# Altium schematic sheet 05_Wifi_Interface.SchDoc: Mainboard Wifi
size A3; SheetNumber: 9; SheetTotal: 13
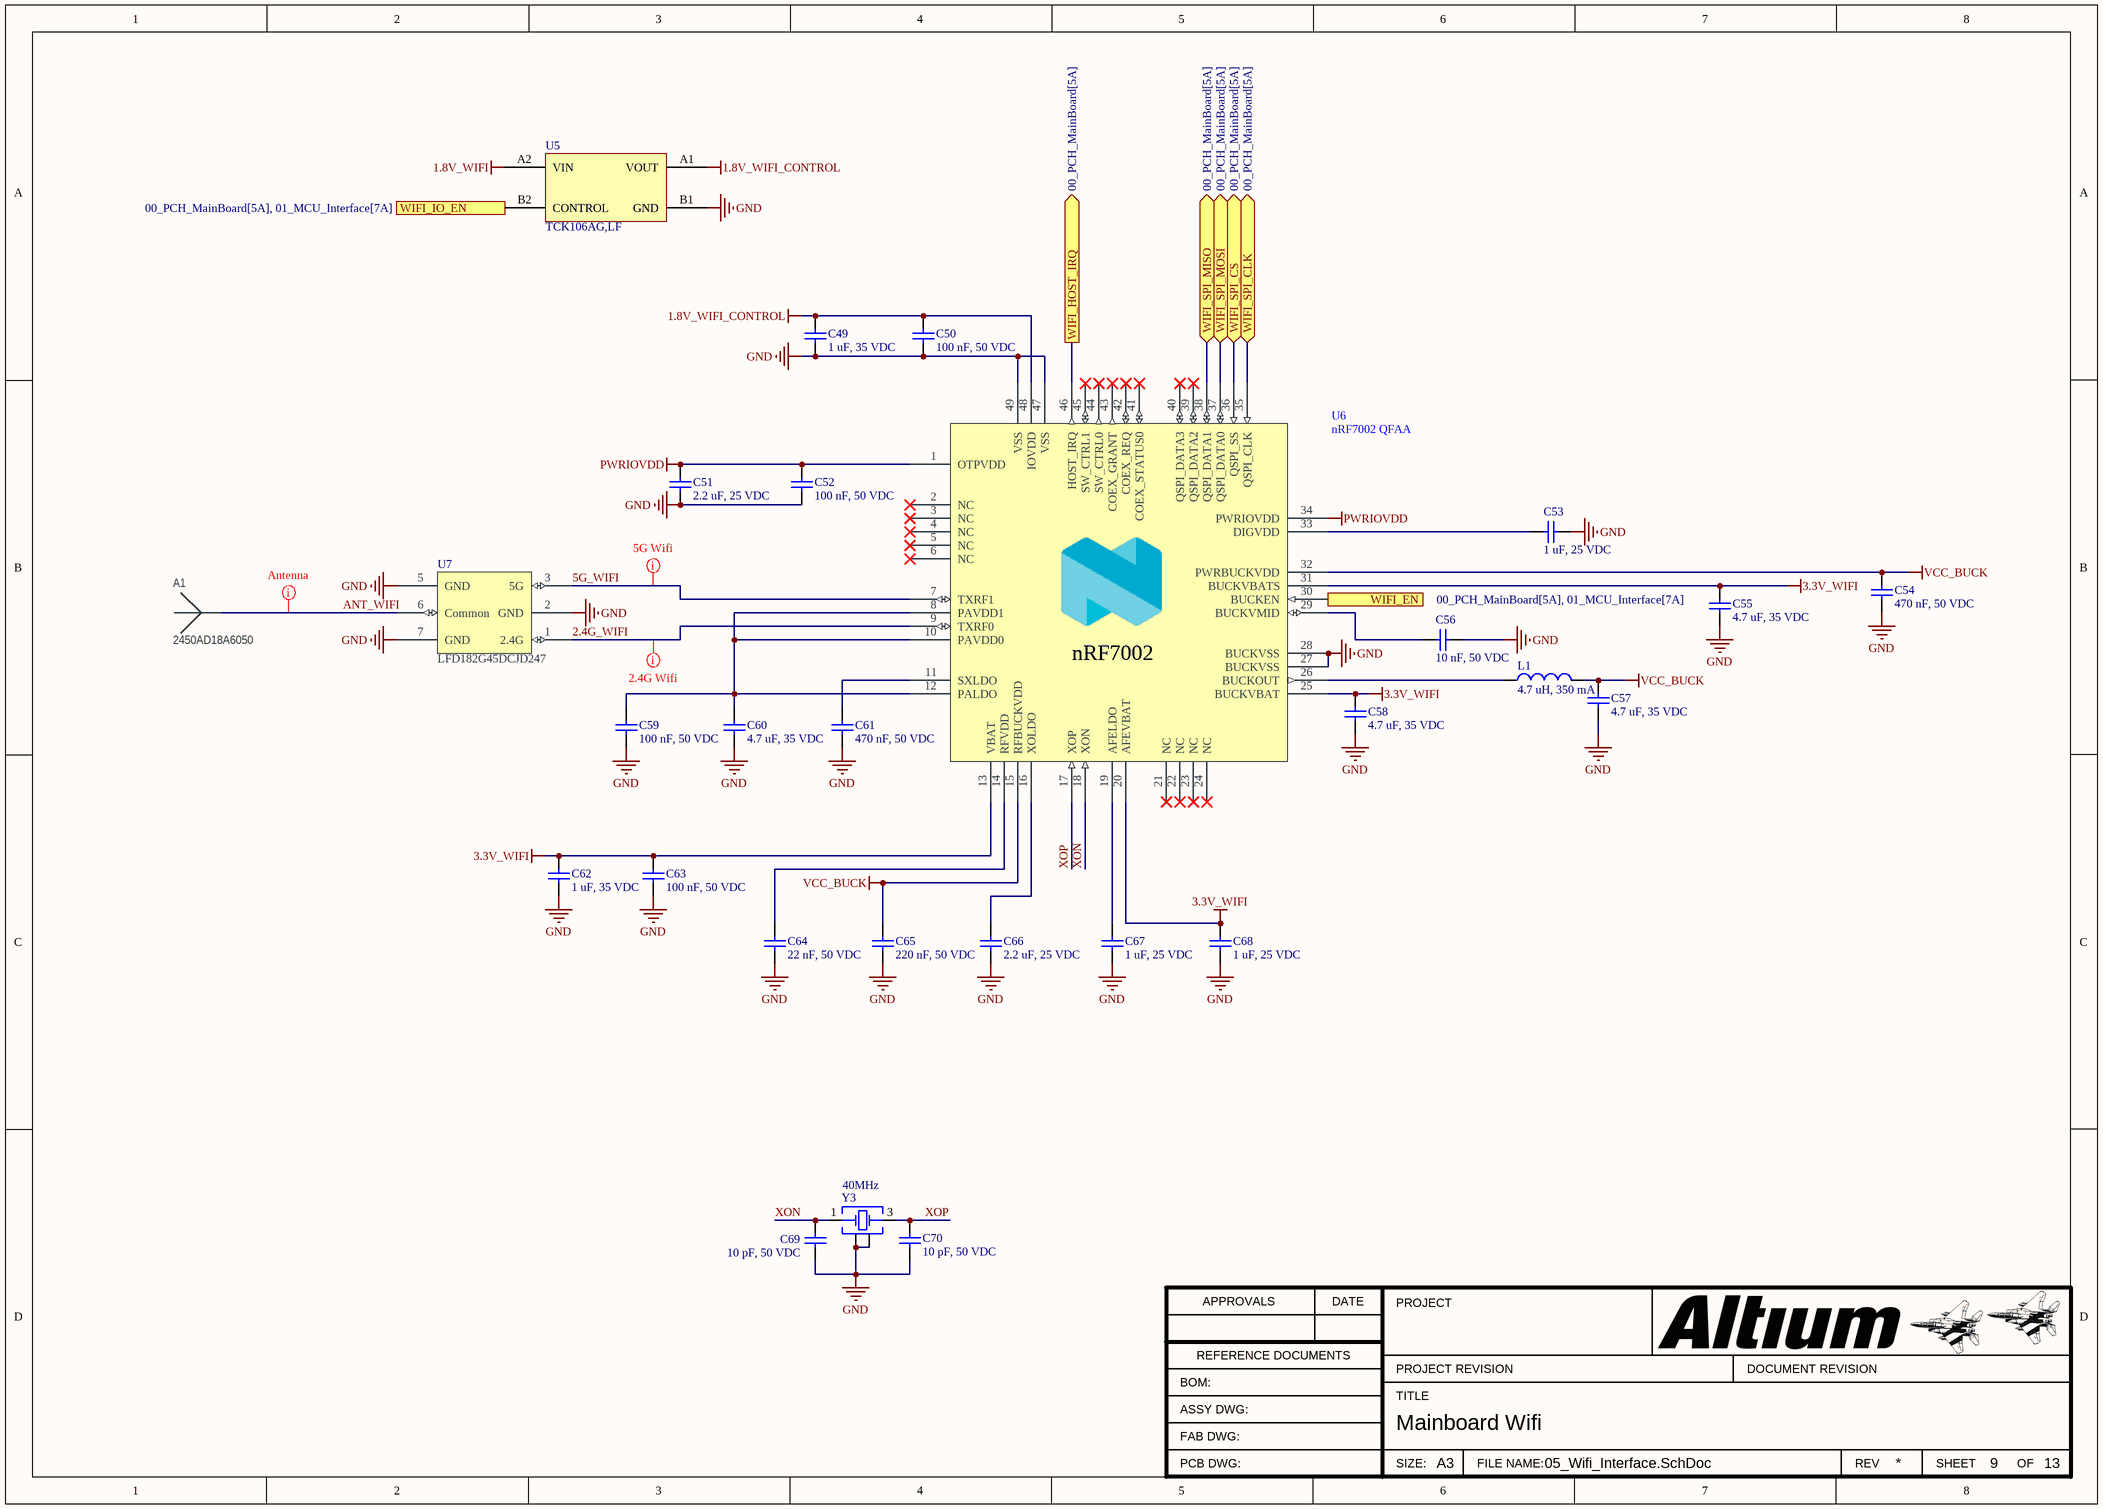
[diagram p0: 05_Wifi_Interface.SchDoc]

## Parts
A1  2450AD18A6050  [2450AD18A6050]
C49  1 uF, 35 VDC  [CAP_0603]
C50  100 nF, 50 VDC  [CAP_0603]
C51  2.2 uF, 25 VDC  [CAP_0603]
C52  100 nF, 50 VDC  [CAP_0603]
C53  1 uF, 25 VDC  [CAP_0603]
C54  470 nF, 50 VDC  [CAP_0603]
C55  4.7 uF, 35 VDC  [CAP_0603]
C56  10 nF, 50 VDC  [CAP_0603]
C57  4.7 uF, 35 VDC  [CAP_0603]
C58  4.7 uF, 35 VDC  [CAP_0603]
C59  100 nF, 50 VDC  [CAP_0603]
C60  4.7 uF, 35 VDC  [CAP_0603]
C61  470 nF, 50 VDC  [CAP_0603]
C62  1 uF, 35 VDC  [CAP_0603]
C63  100 nF, 50 VDC  [CAP_0603]
C64  22 nF, 50 VDC  [CAP_0603]
C65  220 nF, 50 VDC  [CAP_0603]
C66  2.2 uF, 25 VDC  [CAP_0603]
C67  1 uF, 25 VDC  [CAP_0603]
C68  1 uF, 25 VDC  [CAP_0603]
C69  10 pF, 50 VDC  [CAP_0603]
C70  10 pF, 50 VDC  [CAP_0603]
L1  4.7 uH, 350 mA  [0603]
U5  TCK106AG,LF  [TCK106AG,LF]
U6  nRF7002 QFAA  [nRF7002]
U7  value LFD182G45DCJD247  [CAF-50P160X80-6N]  (hidden comment: LFD_Diplexer)
Y3  40MHz  [WE-XTAL_CFPX-180]

## Ports
WIFI_EN (in, see 00_PCH_MainBoard[5A], 01_MCU_Interface[7A]), WIFI_HOST_IRQ (out, see 00_PCH_MainBoard[5A]), WIFI_IO_EN (in, see 00_PCH_MainBoard[5A], 01_MCU_Interface[7A]), WIFI_SPI_CLK (bidir, see 00_PCH_MainBoard[5A]), WIFI_SPI_CS (bidir, see 00_PCH_MainBoard[5A]), WIFI_SPI_MISO (bidir, see 00_PCH_MainBoard[5A]), WIFI_SPI_MOSI (bidir, see 00_PCH_MainBoard[5A])

## Nets
1.8V_WIFI: U5.A2(VIN)
1.8V_WIFI_CONTROL: C49.2 C50.2 U5.A1(VOUT) U6.48(IOVDD)
3.3V_WIFI: C55.2 C58.2 C62.2 C63.2 C68.2 U6.13(VBAT) U6.20(AFEVBAT) U6.25(BUCKVBAT) U6.31(BUCKVBATS)
GND: C49.1 C50.1 C51.1 C52.1 C53.2 C54.1 C55.1 C56.2 C57.1 C58.1 C59.1 C60.1 C61.1 C62.1 C63.1 C64.1 C65.1 C66.1 C67.1 C68.1 C69.1 C70.1 U5.B1(GND) U6.27(BUCKVSS) U6.28(BUCKVSS) U6.47(VSS) U6.49(VSS) U7.2(GND) U7.5(GND) U7.7(GND) Y3.2(GND) Y3.4(GND)
PWRIOVDD: C51.2 C52.2 U6.1(OTPVDD) U6.34(PWRIOVDD)
VCC_BUCK: C54.2 C57.2 C65.2 L1.2 U6.15(RFBUCKVDD) U6.32(PWRBUCKVDD)
2.4G_WIFI: U6.9(TXRF0) U7.1(2.4G)
5G_WIFI: U6.7(TXRF1) U7.3(5G)
ANT_WIFI: A1.1 U7.6(Common)
WIFI_EN: U6.30(BUCKEN) ; port WIFI_EN
WIFI_HOST_IRQ: U6.46(HOST_IRQ) ; port WIFI_HOST_IRQ
WIFI_IO_EN: U5.B2(CONTROL) ; port WIFI_IO_EN
WIFI_SPI_CLK: U6.35(QSPI_CLK) ; port WIFI_SPI_CLK
WIFI_SPI_CS: U6.36(QSPI_SS) ; port WIFI_SPI_CS
WIFI_SPI_MISO: U6.38(QSPI_DATA1) ; port WIFI_SPI_MISO
WIFI_SPI_MOSI: U6.37(QSPI_DATA0) ; port WIFI_SPI_MOSI
XON: C69.2 U6.18(XON) Y3.1(Crystal)
XOP: C70.2 U6.17(XOP) Y3.3(Crystal)
NetC53_1: C53.1 U6.33(DIGVDD)
NetC56_1: C56.1 U6.29(BUCKVMID)
NetC59_2: C59.2 C60.2 U6.8(PAVDD1) U6.10(PAVDD0) U6.12(PALDO)
NetC61_2: C61.2 U6.11(SXLDO)
NetC64_2: C64.2 U6.14(RFVDD)
NetC66_2: C66.2 U6.16(XOLDO)
NetC67_2: C67.2 U6.19(AFELDO)
NetL1_1: L1.1 U6.26(BUCKOUT)

Not connected (* = marked no-connect by the designer): U6 2(NC)* 3(NC)* 4(NC)* 5(NC)* 6(NC)* 21(NC)* 22(NC)* 23(NC)* 24(NC)* 39(QSPI_DATA2)* 40(QSPI_DATA3)* 41(COEX_STATUS0)* 42(COEX_REQ)* 43(COEX_GRANT)* 44(SW_CTRL0)* 45(SW_CTRL1)*

## Layout directives
rule Signal Stimulus [Kind - Periodic Pulse    Level - Low    Start Time = 0.000    Stop Time = 0.000    Period Time = 200.0p]; net class WIFI: 5G_WIFI
rule Signal Stimulus [Kind - Periodic Pulse    Level - Low    Start Time = 0.000    Stop Time = 0.000    Period Time = 416.7p]; net class WIFI: 2.4G_WIFI
rule Signal Stimulus [Kind - Single Pulse    Level - Low    Start Time = 0.000    Stop Time = 0.000    Period Time = 200.0p]; net class WIFI: ANT_WIFI

## Notes on the sheet
- APPROVALS
- DATE
- PROJECT
- BOM:
- REFERENCE DOCUMENTS
- TITLE
- PROJECT REVISION
- DOCUMENT REVISION
- ASSY DWG:
- FAB DWG:
- PCB DWG:
- SIZE:
- A3
- FILE NAME:
- REV
- SHEET
- OF

## Library data of the parts
A1 = 2450AD18A6050: 2.4, 5, and 6GHz BT/WiFi6E Mini Antenna, Single-feed, Tri-band, Corner Mount; Manufacturer: Johanson Technology; Part number NEMS: 100700074; Pad Count: 2; Note: N.A.; Component Status: Active; Part Number: 2450AD18A6050; PartId: 100700074; Component Class: Antennas; Author: hany; Manufacturer Part Number: 2450AD18A6050; ComponentLink1URL: https://www.johansontechnology.com/datasheets/2450AD18A6050/2450AD18A6050.pdf; ComponentLink1Description: Datasheet; ComponentLink2URL: N.A.; ComponentLink2Description: Supplier link; HelpURL: N.A.; Footprint Doc: 2450AD18A6050; LatestRevisionDate: 2022-01-21; Published: 2022-01-21; Value: 2450AD18A6050; Supplier 1: Digi-Key; Supplier Part Number 1: 712-2450AD18A6050ETR-ND; Supplier 2: Mouser; Supplier Part Number 2: 609-2450AD18A6050; Artikkelnr Noca: N.A.; Part number IPS: N.A.; Part number Norautron: N.A.; Supplier 1 URL: https://www.mouser.vn/ProductDetail/Johanson-Technology/2450AD18A6050?qs=XAiT9M5g4x9yG1njx84DMw%3D%3D; Supplier 2 URL: N.A
C49 C62 = 0106031051035: CAP, size 0603, 1 uF, 35 VDC; Manufacture Name: Samsung Electro-Mechanics; Manufacture SN: CL10B105KL9VPJC; Capacitance: 1 uF; Tolerance: +/-10%; Voltage Rating DC: 35 VDC; ComponentLink2Description: Datasheet; ComponentLink2URL: https://www.mouser.vn/datasheet/2/585/Samsung_3_7_2023_CL21Y106KABVPN_Specsheet-3106720.pdf; Operating Temperature: -55 to +125degC; Packaging: Tape and Reel; Mounting Technology: SMT; Size: 0603; Supplier 1 Name: Mouser; Supplier 1 SN: 187-CL10B105KL9VPJC; Supplier 1 URL: https://www.mouser.vn/ProductDetail/Samsung-Electro-Mechanics/CL10B105KL9VPJC?qs=Jm2GQyTW%2Fbg7HPXOYntRzg%3D%3D&utm_source=mouser-refine-download&utm_medium=file&utm_campaign=CL10B105KL9VPJC&utm_content=Samsung-Electro-Mechanics; Supplier 2 Name: Digi-Key; Supplier 2 SN: N/A; Supplier 2 URL: N/A; Supplier 3 Name: thegioiic; Supplier 3 SN: N/A; Supplier 3 URL: N/A; Value: 1 uF, 35 VDC
C50 C52 C59 C63 = 0106031041050: CAP, size 0603, 100 nF, 50 VDC; Manufacture Name: TDK; Manufacture SN: CGA3E3X8R1H104K080AE; Capacitance: 100 nF; Tolerance: +/-10%; Voltage Rating DC: 50 VDC; ComponentLink2Description: Datasheet; ComponentLink2URL: https://product.tdk.com/system/files/dam/doc/product/capacitor/ceramic/mlcc/catalog/mlcc_automotive_soft_en.pdf?ref_disty=mouser; Operating Temperature: -55 to +125degC; Packaging: Tape and Reel; Mounting Technology: SMT; Size: 0603; Supplier 1 Name: Mouser; Supplier 1 SN: 810-CGA3E3X8R1H104KA; Supplier 1 URL: https://www.mouser.com/ProductDetail/TDK/CGA3E3X8R1H104K080AE?qs=nQSIdc08i%252Bd8g3IRRgU2bw%3D%3D&utm_source=mouser-refine-download&utm_medium=file&utm_campaign=CGA3E3X8R1H104K080AE&utm_content=TDK; Supplier 2 Name: Digi-Key; Supplier 2 SN: 445-173697-2-ND; Supplier 2 URL: https://www.digikey.com/en/products/detail/tdk-corporation/cga3e3x8r1h104k080ae/5809262; Supplier 3 Name: thegioiic; Supplier 3 SN: N/A; Supplier 3 URL: N/A; Value: 100 nF, 50 VDC
C51 C66 = 0106032251025: CAP, size 0603, 2.2 uF, 25 VDC; Manufacture Name: Samsung Electro-Mechanics; Manufacture SN: CL10A225KA5LNNC; Capacitance: 2.2 uF; Tolerance: +/-10%; Voltage Rating DC: 25 VDC; ComponentLink2Description: Datasheet; ComponentLink2URL: https://www.mouser.vn/datasheet/2/585/MLCC-1837944.pdf; Operating Temperature: -55 to +125degC; Packaging: Tape and Reel; Mounting Technology: SMT; Size: 0603; Supplier 1 Name: Mouser; Supplier 1 SN: 187-CL10A225KA5LNNC; Supplier 1 URL: https://www.mouser.vn/ProductDetail/Samsung-Electro-Mechanics/CL10A225KA5LNNC?qs=xo2MLhA0R3XJQvhdoYgMfw%3D%3D&utm_source=mouser-refine-download&utm_medium=file&utm_campaign=CL10A225KA5LNNC&utm_content=Samsung-Electro-Mechanics; Supplier 2 Name: Digi-Key; Supplier 2 SN: 1276-1878-2-ND; Supplier 2 URL: https://www.digikey.com/en/products/detail/samsung-electro-mechanics/cl10a225ka5lnnc/3887536; Supplier 3 Name: thegioiic; Supplier 3 SN: N/A; Supplier 3 URL: N/A; Value: 2.2 uF, 25 VDC
C53 C67 C68 = 0106031051025: CAP, size 0603, 1 uF, 25 VDC; Manufacture Name: Samsung Electro-Mechanics; Manufacture SN: CL10A105KA8NNNC; Capacitance: 1 uF; Tolerance: +/-10%; Voltage Rating DC: 25 VDC; ComponentLink2Description: Datasheet; ComponentLink2URL: https://www.mouser.vn/datasheet/2/585/MLCC-1837944.pdf; Operating Temperature: -55 to +125degC; Packaging: Tape and Reel; Mounting Technology: SMT; Size: 0603; Supplier 1 Name: Mouser; Supplier 1 SN: 187-CL10A105KA8NNNC; Supplier 1 URL: https://www.mouser.vn/ProductDetail/Samsung-Electro-Mechanics/CL10A105KA8NNNC?qs=hqM3L16%252BxldY%252BnK4KzDJVg%3D%3D&utm_source=mouser-refine-download&utm_medium=file&utm_campaign=CL10A105KA8NNNC&utm_content=Samsung-Electro-Mechanics; Supplier 2 Name: Digi-Key; Supplier 2 SN: 1276-1102-2-ND; Supplier 2 URL: https://www.digikey.com/en/products/detail/samsung-electro-mechanics/cl10a105ka8nnnc/3886760; Supplier 3 Name: thegioiic; Supplier 3 SN: N/A; Supplier 3 URL: N/A; Value: 1 uF, 25 VDC
C54 C61 = 0106034741050: CAP, size 0603, 470 nF, 50 VDC; Manufacture Name: TDK; Manufacture SN: CGA3E3X7R1H474K080AB; Capacitance: 470 nF; Tolerance: +/-10%; Voltage Rating DC: 50 VDC; ComponentLink2Description: Datasheet; ComponentLink2URL: https://product.tdk.com/system/files/dam/doc/product/capacitor/ceramic/mlcc/catalog/mlcc_automotive_general_en.pdf?ref_disty=mouser; Operating Temperature: -55 to +125degC; Packaging: Tape and Reel; Mounting Technology: SMT; Size: 0603; Supplier 1 Name: Mouser; Supplier 1 SN: 810-CGA3E3X7R1H474KB; Supplier 1 URL: https://www.mouser.com/ProductDetail/TDK/CGA3E3X7R1H474K080AB?qs=xLDY6iXSiQYK0oGm7fVVjw%3D%3D&utm_source=mouser-refine-download&utm_medium=file&utm_campaign=CGA3E3X7R1H474K080AB&utm_content=TDK; Supplier 2 Name: Digi-Key; Supplier 2 SN: 445-175200-2-ND; Supplier 2 URL: https://www.digikey.com/en/products/detail/tdk-corporation/cga3e3x7r1h474k080ab/4931467; Supplier 3 Name: thegioiic; Supplier 3 SN: N/A; Supplier 3 URL: N/A; Value: 470 nF, 50 VDC
C55 C57 C58 C60 = 0106034751035: CAP, size 0603, 4.7 uF, 35 VDC; Manufacture Name: Samsung Electro-Mechanics; Manufacture SN: CL10A475KL8NRNC; Capacitance: 4.7 uF; Tolerance: +/-10%; Voltage Rating DC: 35 VDC; ComponentLink2Description: Datasheet; ComponentLink2URL: https://www.mouser.vn/datasheet/2/585/MLCC-1837944.pdf; Operating Temperature: -55 to +125degC; Packaging: Tape and Reel; Mounting Technology: SMT; Size: 0603; Supplier 1 Name: Mouser; Supplier 1 SN: 187-CL10A475KL8NRNC; Supplier 1 URL: https://www.mouser.vn/ProductDetail/Samsung-Electro-Mechanics/CL10A475KL8NRNC?qs=xZ%2FP%252Ba9zWqa0jfvJtp%252BUEg%3D%3D&utm_source=mouser-refine-download&utm_medium=file&utm_campaign=CL10A475KL8NRNC&utm_content=Samsung-Electro-Mechanics; Supplier 2 Name: Digi-Key; Supplier 2 SN: 1276-6794-2-ND; Supplier 2 URL: https://www.digikey.com/en/products/detail/samsung-electro-mechanics/cl10a475kl8nrnc/5961278; Supplier 3 Name: thegioiic; Supplier 3 SN: N/A; Supplier 3 URL: N/A; Value: 4.7 uF, 35 VDC
C56 = 0106031030550: CAP, size 0603, 10 nF, 50 VDC; Manufacture Name: TDK; Manufacture SN: CGA3E2C0G1H103J080AE; Capacitance: 10 nF; Tolerance: +/-5%; Voltage Rating DC: 50 VDC; ComponentLink2Description: Datasheet; ComponentLink2URL: https://product.tdk.com/system/files/dam/doc/product/capacitor/ceramic/mlcc/catalog/mlcc_automotive_soft_en.pdf?ref_disty=mouser; Operating Temperature: -55 to +125degC; Packaging: Tape and Reel; Mounting Technology: SMT; Size: 0603; Supplier 1 Name: Mouser; Supplier 1 SN: 810-CGA3E2C0G1H103J8; Supplier 1 URL: https://www.mouser.com/ProductDetail/TDK/CGA3E2C0G1H103J080AE?qs=P1JMDcb91o6ZkMITrWTUZQ%3D%3D&utm_source=mouser-refine-download&utm_medium=file&utm_campaign=CGA3E2C0G1H103J080AE&utm_content=TDK; Supplier 2 Name: Digi-Key; Supplier 2 SN: 445-CGA3E2C0G1H103J080AETR-ND; Supplier 2 URL: https://www.digikey.com/en/products/detail/tdk-corporation/cga3e2c0g1h103j080ae/11697946; Supplier 3 Name: thegioiic; Supplier 3 SN: N/A; Supplier 3 URL: N/A; Value: 10 nF, 50 VDC
C64 = 0106032231050: CAP, size 0603, 22 nF, 50 VDC; Manufacture Name: TDK; Manufacture SN: CGA3E2X7R1H223K080AE; Capacitance: 22 nF; Tolerance: +/-10%; Voltage Rating DC: 50 VDC; ComponentLink2Description: Datasheet; ComponentLink2URL: https://product.tdk.com/system/files/dam/doc/product/capacitor/ceramic/mlcc/catalog/mlcc_automotive_soft_en.pdf?ref_disty=mouser; Operating Temperature: -55 to +125degC; Packaging: Tape and Reel; Mounting Technology: SMT; Size: 0603; Supplier 1 Name: Mouser; Supplier 1 SN: 810-CGA3E2X7R1H223KA; Supplier 1 URL: https://www.mouser.com/ProductDetail/TDK/CGA3E2X7R1H223K080AE?qs=nQSIdc08i%252Bf9AsEN7N%2FMeQ%3D%3D&utm_source=mouser-refine-download&utm_medium=file&utm_campaign=CGA3E2X7R1H223K080AE&utm_content=TDK; Supplier 2 Name: Digi-Key; Supplier 2 SN: 445-173696-2-ND; Supplier 2 URL: https://www.digikey.com/en/products/detail/tdk-corporation/cga3e2x7r1h223k080ae/5809261; Supplier 3 Name: thegioiic; Supplier 3 SN: N/A; Supplier 3 URL: N/A; Value: 22 nF, 50 VDC
C65 = 0106032241050: CAP, size 0603, 220 nF, 50 VDC; Manufacture Name: TDK; Manufacture SN: CGA3E3X7R1H224K080AE; Capacitance: 220 nF; Tolerance: +/-10%; Voltage Rating DC: 50 VDC; ComponentLink2Description: Datasheet; ComponentLink2URL: https://product.tdk.com/system/files/dam/doc/product/capacitor/ceramic/mlcc/catalog/mlcc_automotive_soft_en.pdf?ref_disty=mouser; Operating Temperature: -55 to +125degC; Packaging: Tape and Reel; Mounting Technology: SMT; Size: 0603; Supplier 1 Name: Mouser; Supplier 1 SN: 810-CGA3E3X7R1H224KA; Supplier 1 URL: https://www.mouser.com/ProductDetail/TDK/CGA3E3X7R1H224K080AE?qs=nQSIdc08i%252Bd73MzLq310Yg%3D%3D&utm_source=mouser-refine-download&utm_medium=file&utm_campaign=CGA3E3X7R1H224K080AE&utm_content=TDK; Supplier 2 Name: Digi-Key; Supplier 2 SN: 445-173635-2-ND; Supplier 2 URL: https://www.digikey.com/en/products/detail/tdk-corporation/cga3e3x7r1h224k080ae/5809200; Supplier 3 Name: thegioiic; Supplier 3 SN: N/A; Supplier 3 URL: N/A; Value: 220 nF, 50 VDC
C69 C70 = 0106031000550: CAP, size 0603, 10 pF, 50 VDC; Manufacture Name: TDK; Manufacture SN: CGA3E2NP01H100D080AA; Capacitance: 10 pF; Tolerance: +/-5%; Voltage Rating DC: 50 VDC; ComponentLink2Description: Datasheet; ComponentLink2URL: https://product.tdk.com/system/files/dam/doc/product/capacitor/ceramic/mlcc/catalog/mlcc_automotive_hightemp_en.pdf?ref_disty=mouser; Operating Temperature: -55 to +125degC; Packaging: Tape and Reel; Mounting Technology: SMT; Size: 0603; Supplier 1 Name: Mouser; Supplier 1 SN: 810-CGA3E2NP01H100DA; Supplier 1 URL: https://www.mouser.com/ProductDetail/TDK/CGA3E2NP01H100D080AA?qs=xLDY6iXSiQYSDBjUp7bVxg%3D%3D&utm_source=mouser-refine-download&utm_medium=file&utm_campaign=CGA3E2NP01H100D080AA&utm_content=TDK; Supplier 2 Name: Digi-Key; Supplier 2 SN: 445-12387-2-ND; Supplier 2 URL: https://www.digikey.com/en/products/detail/tdk-corporation/cga3e2np01h100d080aa/3949623; Supplier 3 Name: thegioiic; Supplier 3 SN: N/A; Supplier 3 URL: N/A; Value: 10 pF, 50 VDC
L1 = 02060347520350: Inductor SMD, size 0603, 4.7 uH, 350 mA; Manufacture Name: TDK; Manufacture SN: MLZ1608M4R7WTD25; Inductance: 4.7 uH; Tolerance: 20%; Maximum DC Current: 350 mA; Maximum DC Resistance: 500 mOhms; Saturation Current: 120 mA; ComponentLink2Description: Supplier 1 URL; ComponentLink2URL: https://www.mouser.vn/ProductDetail/TDK/MLZ1608M4R7WTD25?qs=u4%252BEJ9urDARoIG2pH84vrg%3D%3D; Mounting Technology: SMT; Operating Temperature: -55 to +125degC; Packaging: Tape and Reel; Size: 0603; Supplier 1 Name: Mouser; Supplier 1 SN: 810-MLZ1608M4R7WTD25; Supplier 1 URL: https://www.mouser.vn/ProductDetail/TDK/MLZ1608M4R7WTD25?qs=u4%252BEJ9urDARoIG2pH84vrg%3D%3D; Supplier 2 Name: Digi-Key; Supplier 2 SN: 445-181774-2-ND; Supplier 2 URL: https://www.digikey.com/en/products/detail/tdk-corporation/MLZ1608M4R7WTD25/4743175; Supplier 3 Name: thegioiic; Supplier 3 SN: OEM; Supplier 3 URL: N/A; ComponentLink1Description: Datasheet; ComponentLink1URL: https://product.tdk.com/system/files/dam/doc/product/inductor/inductor/smd/catalog/inductor_automotive_decoupling_mlz1608_en.pdf?ref_disty=mouser; ComponentLink3Description: Supplier 2 URL; ComponentLink3URL: https://www.digikey.com/en/products/detail/tdk-corporation/MLZ1608M4R7WTD25/4743175; ComponentLink4Description: Supplier 3 URL; Value: 4.7 uH, 350 mA
U5 = TCK106AG,LF: Power Switch ICs - Power Distribution Load Switch IC; Manufacturer: Toshiba; Current Output: 1 A; PSRR: - 70 dB; Rated Current: 90 uA; Voltage Input Maximum: 5.5V; Voltage Input Minimum: 1.1V; Voltage Output: 5V; Off time: 5 us; On Resistor: 55 mOhms; On time: 305 us; Pd - Power Dissipation: 800 mW; ComponentLink1Description: Datasheet link; ComponentLink1URL: https://www.mouser.vn/datasheet/2/408/TCK106AG_datasheet_en_20151005-1916439.pdf; ComponentLink2Description: Supplier 1 URL; ComponentLink2URL: https://www.mouser.vn/ProductDetail/Toshiba/TCK106AGLF?qs=lX6dEUlT%252BgdlAjab8mTlWw%3D%3D; ComponentLink3Description: Supplier 2 URL; ComponentLink3URL: https://www.digikey.com/en/products/detail/toshiba-semiconductor-and-storage/TCK106AG-LF/5409248; ComponentLink4Description: Supplier 3 URL; ComponentLink4URL: N/A; Manufacturer Part Number: TCK106AG,LF; Mounting Technology: SMD; Operating Temperature: - 40 C to  + 85 C; Packaging: BGA; Product: LDO Voltage Regulators; Supplier 1 Name: Mouser; Supplier 1 SN: 757-TCK106AGLF; Supplier 1 URL: https://www.mouser.vn/ProductDetail/Toshiba/TCK106AGLF?qs=lX6dEUlT%252BgdlAjab8mTlWw%3D%3D; Supplier 2 Name: Digi-Key; Supplier 2 SN: TCK106AGLFTR-ND; Supplier 2 URL: https://www.digikey.com/en/products/detail/toshiba-semiconductor-and-storage/TCK106AG-LF/5409248; Supplier 3 Name: thegioiic; Supplier 3 SN: N/A; Supplier 3 URL: N/A; Value: TCK106AG,LF
U6 = nRF7002: Wifi Dual Band Companion chip; Manufacturer: Nordic Semiconductor; Manufacturer Part Number: nRF7002-QFAAAA; Pad Count: 49; Note: N.A.; Part Number: nRF7002; Component Class: nRF_Devices; Author: hany; ComponentLink1URL: https://www.mouser.sg/datasheet/2/297/Nordic_Semiconductor_1_6_2023_nRF7002_IC_Product_B-3084788.pdf; ComponentLink1Description: Datasheet link; ComponentLink2URL: https://www.mouser.sg/c/?q=NRF7002-QFAA-R; ComponentLink2Description: Supplier 1 URL; HelpURL: N.A.; Footprint Doc: QFN-48; LatestRevisionDate: 2021-09-16; Published: 2021-09-16; Value: nRF7002 QFAA; Supplier 1 Name: Mouser; Supplier 1 SN: nRF7002; Supplier 1 URL: https://www.mouser.sg/c/?q=NRF7002-QFAA-R; Supplier 2 Name: Digi-Key; Supplier 2 SN: N/A; Supplier 2 URL: N/A; Supplier 3 Name: thegioiic; Supplier 3 SN: N/A; Supplier 3 URL: N/A
U7 = LFD182G45DCJD247: Signal Conditioning 2.4GHz and 5GHz Diplexer; Manufacturer: Murata; Part number NEMS: 100800026; Pad Count: 6; Note: N.A.; Component Status: Active; Part Number: LFD182G45DCJD247; Component Class: Filters; Author: hany; Manufacturer Part Number: LFD182G45DCJD247; ComponentLink1URL: https://no.mouser.com/datasheet/2/281/1/LFD182G45DCJD247-2399435.pdf; ComponentLink1Description: Datasheet; ComponentLink2URL: N.A.; ComponentLink2Description: Supplier link; HelpURL: N.A.; Footprint Doc: CAF; LatestRevisionDate: 2021-10-06; Published: 2021-10-06; Artikkelnr Noca: N.A.; Part number IPS: N.A.; Part number Norautron: N.A.; PartId: 100800026; Supplier 1 Name: Mouser; Supplier 1 SN: 81-LFD182G45DCJD247; Supplier 2 Name: N.A.; Supplier 2 SN: N.A.
Y3 = 073525406018: WE-XTAL Quartz Crystal, SMT, CFPX-180, 40MHz, +/-20ppm; Manufacturer Part Number: NX3225SA-40M-EXS00A-CS03880; Manufacturer: NDK; Frequency Stability: +/-17ppm; Load Capacitance: 8pF; Frequency Tolerance: +/-10ppm; ComponentLink2Description: Supplier 1 URL; ComponentLink2URL: https://www.mouser.com/ProductDetail/NDK/NX3225SA-40M-EXS00A-CS03880?qs=w%2Fv1CP2dgqo9kGSMUdcrAw%3D%3D; Operating Temperature: -10 to +60degC; Size: CFPX-104/5032; Frequency: 40MHz; Mounting Technology: SMT; Supplier 3 Name: thegioiic; Supplier 3 SN: N/A; Supplier 3 URL: https://www.thegioiic.com/thach-anh-40mhz-5032-4-chan-smd; ComponentLink1Description: Datasheet link; ComponentLink1URL: https://www.mouser.com/datasheet/2/905/ndk_08142018_NX3225SA-40M-EXS00A-CS03880-1389054.pdf; ComponentLink3Description: Supplier 2 URL; ComponentLink3URL: https://www.digikey.com/en/products/detail/ndk-america-inc/NX3225SA-40M-EXS00A-CS03880/5015625; ComponentLink4Description: Supplier 3 URL; ComponentLink4URL: https://www.thegioiic.com/thach-anh-40mhz-5032-4-chan-smd; Supplier 1 Name: Mouser; Supplier 1 SN: 344-NX3225SA40S03880; Supplier 1 URL: https://www.mouser.com/ProductDetail/NDK/NX3225SA-40M-EXS00A-CS03880?qs=w%2Fv1CP2dgqo9kGSMUdcrAw%3D%3D; Supplier 2 Name: Digi-Key; Supplier 2 SN: 644-1249-2-ND; Supplier 2 URL: https://www.digikey.com/en/products/detail/ndk-america-inc/NX3225SA-40M-EXS00A-CS03880/5015625; Value: 40MHz